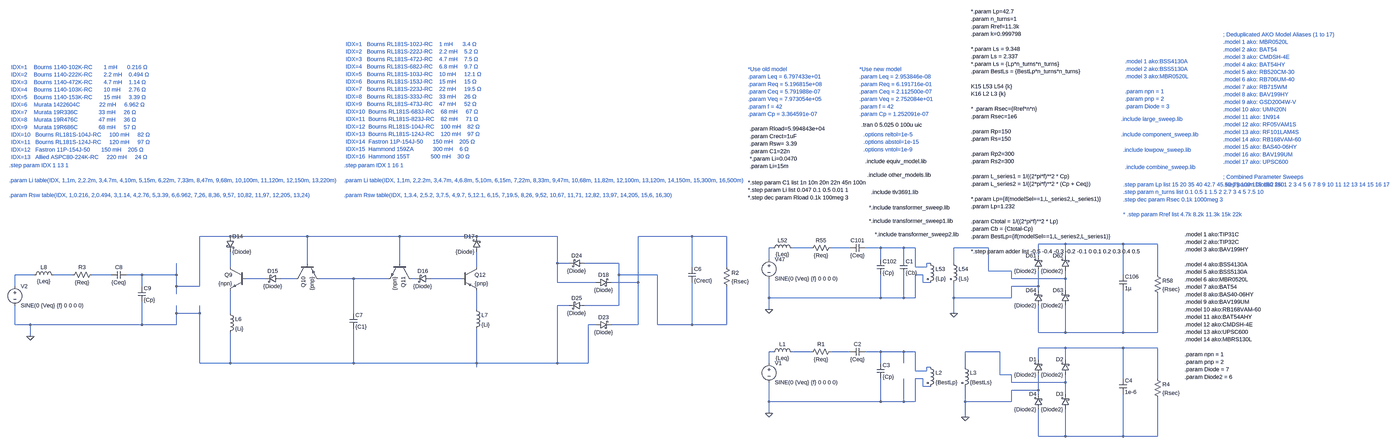
[diagram p0: schematic peh.asc, whole sheet]
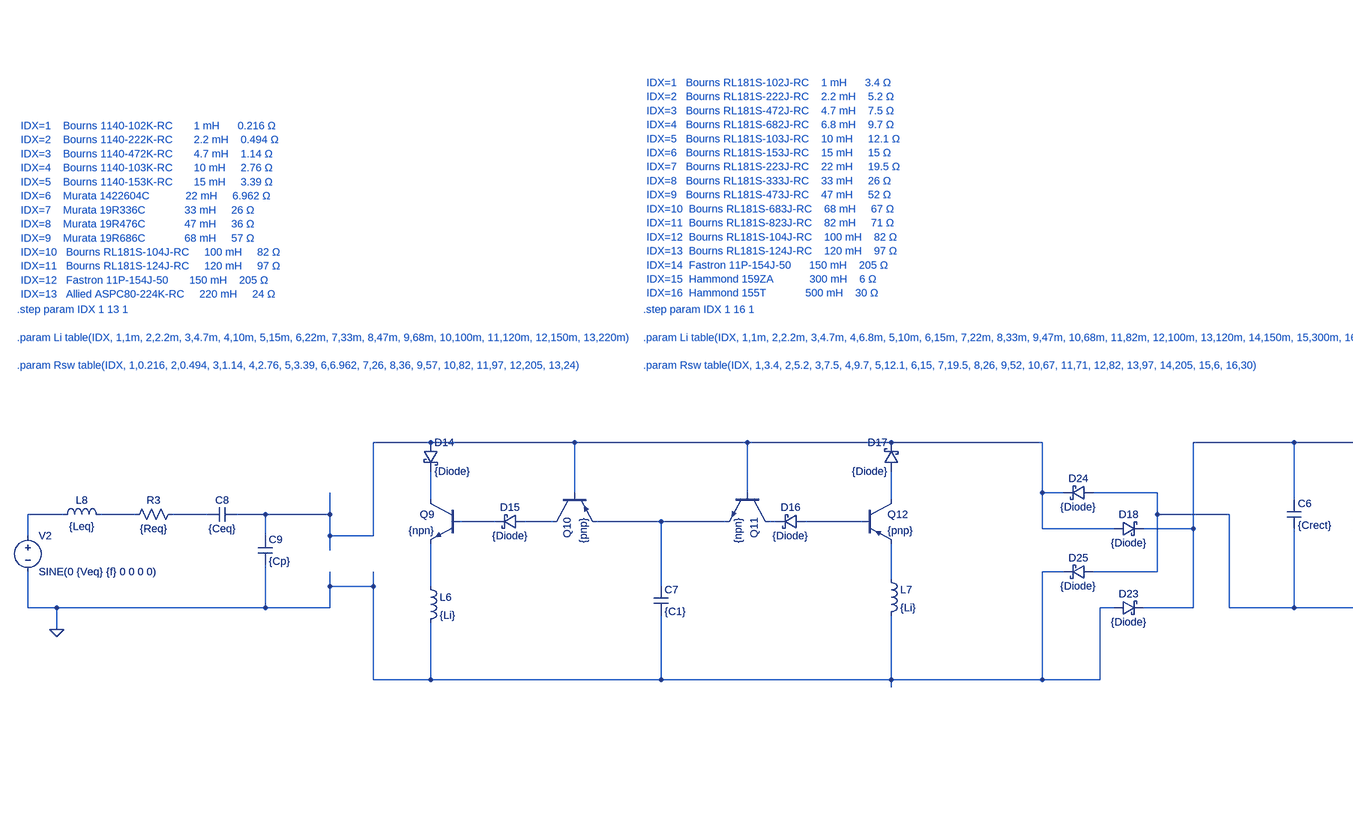
[diagram p1: schematic peh.asc, part, row 1 of 1, column 1 of 2]
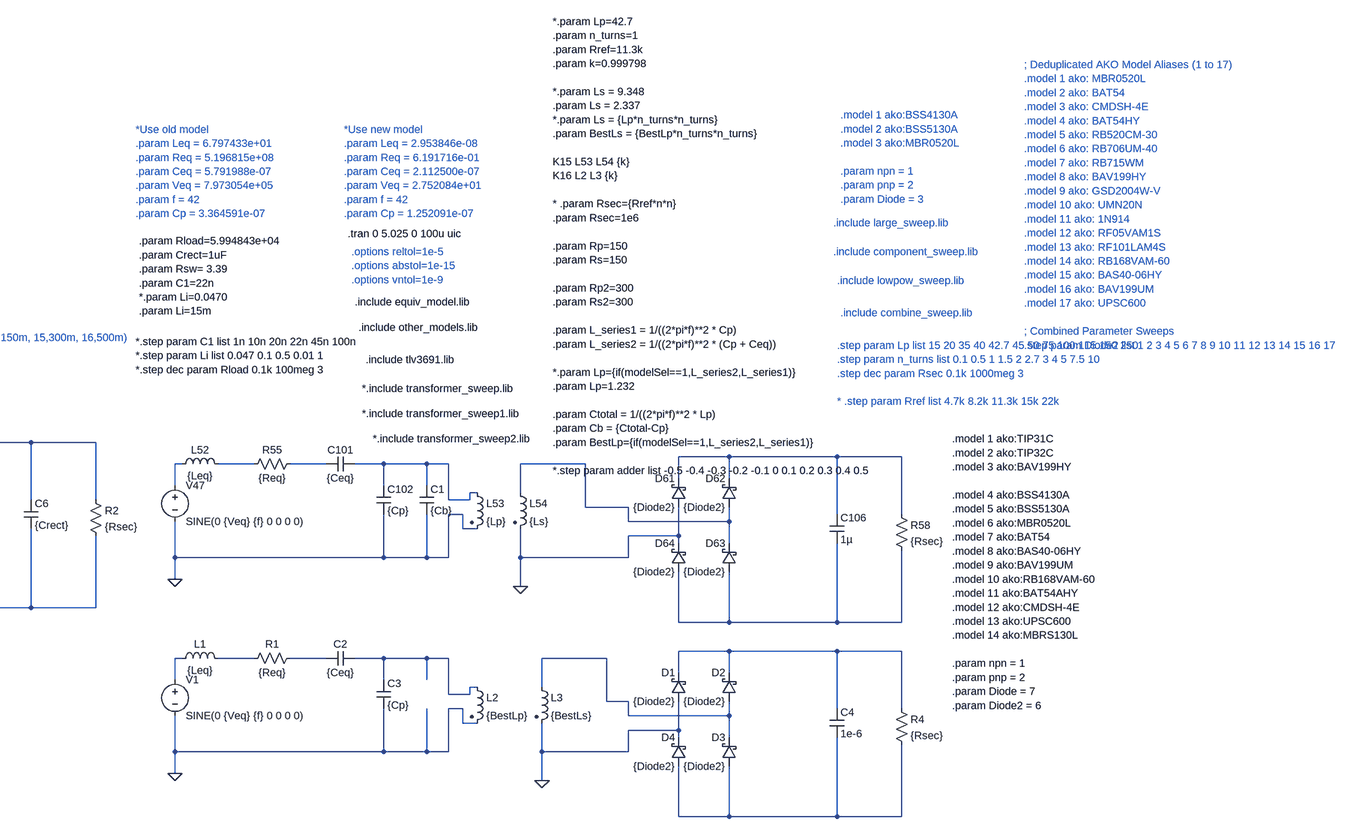
[diagram p2: schematic peh.asc, part, row 1 of 1, column 2 of 2]
peh.asc, the LTspice schematic file:
Version 4
SHEET 1 86052 56212
WIRE 1072 464 944 464
WIRE 1392 464 1072 464
WIRE 1776 464 1392 464
WIRE 2096 464 1776 464
WIRE 2432 464 2096 464
WIRE 2992 464 2768 464
WIRE 3136 464 2992 464
WIRE 4544 496 4432 496
WIRE 4784 496 4544 496
WIRE 4928 496 4784 496
WIRE 3328 512 3312 512
WIRE 3488 512 3408 512
WIRE 3648 512 3568 512
WIRE 3776 512 3712 512
WIRE 3872 512 3776 512
WIRE 3920 512 3872 512
WIRE 4224 512 4080 512
WIRE 4432 544 4432 496
WIRE 4544 544 4544 496
WIRE 3312 560 3312 512
WIRE 3776 560 3776 512
WIRE 3872 560 3872 512
WIRE 1392 576 1392 464
WIRE 1776 576 1776 464
WIRE 2432 576 2432 464
WIRE 2480 576 2432 576
WIRE 2688 576 2544 576
WIRE 3984 576 3968 576
WIRE 4080 576 4080 512
WIRE 1072 592 1072 528
WIRE 2096 592 2096 528
WIRE 2992 592 2992 464
WIRE 3136 592 3136 464
WIRE 3920 592 3920 512
WIRE 3968 592 3968 576
WIRE 3968 592 3920 592
WIRE 4224 608 4224 512
WIRE 4320 608 4224 608
WIRE 256 624 176 624
WIRE 416 624 336 624
WIRE 576 624 496 624
WIRE 704 624 640 624
WIRE 848 624 848 576
WIRE 848 624 704 624
WIRE 2688 624 2688 576
WIRE 2848 624 2688 624
WIRE 3952 624 3920 624
WIRE 4784 624 4784 496
WIRE 4928 624 4928 496
WIRE 1216 640 1136 640
WIRE 1344 640 1280 640
WIRE 1584 640 1440 640
WIRE 1728 640 1584 640
WIRE 1840 640 1824 640
WIRE 2032 640 1904 640
WIRE 4320 640 4320 608
WIRE 4544 640 4544 608
WIRE 4544 640 4320 640
WIRE 2432 656 2432 576
WIRE 2592 656 2432 656
WIRE 2768 656 2768 464
WIRE 2768 656 2656 656
WIRE 3952 656 3952 624
WIRE 3984 656 3952 656
WIRE 176 672 176 624
WIRE 704 672 704 624
WIRE 848 672 848 624
WIRE 944 672 944 464
WIRE 944 672 848 672
WIRE 4432 672 4432 608
WIRE 4432 672 4320 672
WIRE 4432 688 4432 672
WIRE 4544 688 4544 640
WIRE 848 704 848 672
WIRE 3312 720 3312 640
WIRE 3776 720 3776 624
WIRE 3776 720 3312 720
WIRE 3872 720 3872 624
WIRE 3872 720 3776 720
WIRE 3920 720 3920 624
WIRE 3920 720 3872 720
WIRE 4080 720 4080 656
WIRE 4320 720 4320 672
WIRE 4320 720 4080 720
WIRE 2480 752 2432 752
WIRE 2688 752 2688 624
WIRE 2688 752 2544 752
WIRE 2096 768 2096 688
WIRE 3312 768 3312 720
WIRE 848 784 848 752
WIRE 944 784 944 752
WIRE 944 784 848 784
WIRE 1072 784 1072 688
WIRE 1584 784 1584 640
WIRE 4080 784 4080 720
WIRE 176 832 176 752
WIRE 240 832 176 832
WIRE 704 832 704 736
WIRE 704 832 240 832
WIRE 848 832 848 784
WIRE 848 832 704 832
WIRE 2592 832 2560 832
WIRE 2768 832 2768 656
WIRE 2768 832 2656 832
WIRE 2848 832 2848 624
WIRE 2992 832 2992 656
WIRE 2992 832 2848 832
WIRE 3136 832 3136 672
WIRE 3136 832 2992 832
WIRE 4432 864 4432 752
WIRE 4544 864 4544 752
WIRE 4544 864 4432 864
WIRE 4784 864 4784 688
WIRE 4784 864 4544 864
WIRE 4928 864 4928 704
WIRE 4928 864 4784 864
WIRE 240 880 240 832
WIRE 4544 928 4432 928
WIRE 4784 928 4544 928
WIRE 4928 928 4784 928
WIRE 3328 944 3312 944
WIRE 3488 944 3408 944
WIRE 3648 944 3568 944
WIRE 3776 944 3712 944
WIRE 3872 944 3776 944
WIRE 3920 944 3872 944
WIRE 4272 944 4128 944
WIRE 4432 976 4432 928
WIRE 4544 976 4544 928
WIRE 944 992 944 784
WIRE 1072 992 1072 864
WIRE 1072 992 944 992
WIRE 1584 992 1584 848
WIRE 1584 992 1072 992
WIRE 2096 992 2096 848
WIRE 2096 992 1584 992
WIRE 2432 992 2432 752
WIRE 2432 992 2096 992
WIRE 2560 992 2560 832
WIRE 2560 992 2432 992
WIRE 3312 992 3312 944
WIRE 3776 992 3776 944
WIRE 3872 992 3872 944
WIRE 2096 1008 2096 992
WIRE 3984 1008 3968 1008
WIRE 4128 1008 4128 944
WIRE 3920 1024 3920 944
WIRE 3968 1024 3968 1008
WIRE 3968 1024 3920 1024
WIRE 4272 1040 4272 944
WIRE 4320 1040 4272 1040
WIRE 3952 1056 3920 1056
WIRE 4784 1056 4784 928
WIRE 4928 1056 4928 928
WIRE 4320 1072 4320 1040
WIRE 4544 1072 4544 1040
WIRE 4544 1072 4320 1072
WIRE 3952 1088 3952 1056
WIRE 3984 1088 3952 1088
WIRE 4432 1104 4432 1040
WIRE 4432 1104 4320 1104
WIRE 4432 1120 4432 1104
WIRE 4544 1120 4544 1072
WIRE 3312 1152 3312 1072
WIRE 3776 1152 3776 1056
WIRE 3776 1152 3312 1152
WIRE 3872 1152 3872 1056
WIRE 3872 1152 3776 1152
WIRE 3920 1152 3920 1056
WIRE 3920 1152 3872 1152
WIRE 4128 1152 4128 1088
WIRE 4320 1152 4320 1104
WIRE 4320 1152 4128 1152
WIRE 3312 1200 3312 1152
WIRE 4128 1216 4128 1152
WIRE 4432 1296 4432 1184
WIRE 4544 1296 4544 1184
WIRE 4544 1296 4432 1296
WIRE 4784 1296 4784 1120
WIRE 4784 1296 4544 1296
WIRE 4928 1296 4928 1136
WIRE 4928 1296 4784 1296
FLAG 240 880 0
FLAG 3312 768 0
FLAG 4080 784 0
FLAG 3312 1200 0
FLAG 4128 1216 0
SYMBOL schottky 1056 464 R0
SYMATTR InstName D14
SYMATTR Value {Diode}
SYMBOL npn 1136 592 M0
SYMATTR InstName Q9
SYMATTR Value {npn}
SYMBOL schottky 1280 624 R90
WINDOW 0 0 32 VBottom 2
WINDOW 3 32 32 VTop 2
SYMATTR InstName D15
SYMATTR Value {Diode}
SYMBOL schottky 1904 624 R90
WINDOW 0 0 32 VBottom 2
WINDOW 3 32 32 VTop 2
SYMATTR InstName D16
SYMATTR Value {Diode}
SYMBOL pnp 1344 576 M90
SYMATTR InstName Q10
SYMATTR Value {pnp}
SYMBOL npn 1824 576 R90
SYMATTR InstName Q11
SYMATTR Value {npn}
SYMBOL ind 1056 768 R0
SYMATTR InstName L6
SYMATTR Value {Li}
SYMATTR SpiceLine Rser={Rsw}
SYMBOL ind 2080 752 R0
SYMATTR InstName L7
SYMATTR Value {Li}
SYMATTR SpiceLine Rser={Rsw}
SYMBOL pnp 2032 592 R0
SYMATTR InstName Q12
SYMATTR Value {pnp}
SYMBOL schottky 2112 528 R180
WINDOW 0 24 64 Left 2
WINDOW 3 24 0 Left 2
SYMATTR InstName D17
SYMATTR Value {Diode}
SYMBOL schottky 2592 672 R270
WINDOW 0 32 32 VTop 2
WINDOW 3 0 32 VBottom 2
SYMATTR InstName D18
SYMATTR Value {Diode}
SYMBOL schottky 2592 848 R270
WINDOW 0 32 32 VTop 2
WINDOW 3 0 32 VBottom 2
SYMATTR InstName D23
SYMATTR Value {Diode}
SYMBOL schottky 2544 560 R90
WINDOW 0 0 32 VBottom 2
WINDOW 3 32 32 VTop 2
SYMATTR InstName D24
SYMATTR Value {Diode}
SYMBOL schottky 2544 736 R90
WINDOW 0 0 32 VBottom 2
WINDOW 3 32 32 VTop 2
SYMATTR InstName D25
SYMATTR Value {Diode}
SYMBOL cap 2976 592 R0
SYMATTR InstName C6
SYMATTR Value {Crect}
SYMBOL res 3120 576 R0
SYMATTR InstName R2
SYMATTR Value {Rsec}
SYMBOL cap 1568 784 R0
SYMATTR InstName C7
SYMATTR Value {C1}
SYMBOL voltage 176 656 R0
WINDOW 123 0 0 Left 0
WINDOW 39 0 0 Left 0
SYMATTR InstName V2
SYMATTR Value SINE(0 {Veq} {f} 0 0 0 0)
SYMBOL res 512 608 R90
WINDOW 0 0 56 VBottom 2
WINDOW 3 32 56 VTop 2
SYMATTR InstName R3
SYMATTR Value {Req}
SYMBOL ind 240 640 R270
WINDOW 0 32 56 VTop 2
WINDOW 3 5 56 VBottom 2
SYMATTR InstName L8
SYMATTR Value {Leq}
SYMBOL cap 640 608 R90
WINDOW 0 0 32 VBottom 2
WINDOW 3 32 32 VTop 2
SYMATTR InstName C8
SYMATTR Value {Ceq}
SYMBOL cap 688 672 R0
SYMATTR InstName C9
SYMATTR Value {Cp}
SYMBOL res 3584 496 R90
WINDOW 0 0 56 VBottom 2
WINDOW 3 32 56 VTop 2
SYMATTR InstName R55
SYMATTR Value {Req}
SYMBOL ind 3312 528 R270
WINDOW 0 32 56 VTop 2
WINDOW 3 5 56 VBottom 2
SYMATTR InstName L52
SYMATTR Value {Leq}
SYMBOL cap 3712 496 R90
WINDOW 0 0 32 VBottom 2
WINDOW 3 32 32 VTop 2
SYMATTR InstName C101
SYMATTR Value {Ceq}
SYMBOL cap 3760 560 R0
SYMATTR InstName C102
SYMATTR Value {Cp}
SYMBOL voltage 3312 544 R0
WINDOW 123 0 0 Left 0
WINDOW 39 0 0 Left 0
SYMATTR InstName V47
SYMATTR Value SINE(0 {Veq} {f} 0 0 0 0)
SYMBOL ind2 3968 560 R0
SYMATTR InstName L53
SYMATTR Value {Lp}
SYMATTR Type ind
SYMATTR SpiceLine Rser={Rp}
SYMBOL ind2 4064 560 R0
SYMATTR InstName L54
SYMATTR Value {Ls}
SYMATTR Type ind
SYMATTR SpiceLine Rser={Rs}
SYMBOL cap 4768 624 R0
SYMATTR InstName C106
SYMATTR Value 1µ
SYMBOL res 4912 608 R0
SYMATTR InstName R58
SYMATTR Value {Rsec}
SYMBOL schottky 4448 608 R180
WINDOW 0 24 64 Left 2
WINDOW 3 24 0 Left 2
SYMATTR InstName D61
SYMATTR Value {Diode2}
SYMBOL schottky 4560 608 R180
WINDOW 0 24 64 Left 2
WINDOW 3 24 0 Left 2
SYMATTR InstName D62
SYMATTR Value {Diode2}
SYMBOL schottky 4560 752 R180
WINDOW 0 24 64 Left 2
WINDOW 3 24 0 Left 2
SYMATTR InstName D63
SYMATTR Value {Diode2}
SYMBOL schottky 4448 752 R180
WINDOW 0 24 64 Left 2
WINDOW 3 24 0 Left 2
SYMATTR InstName D64
SYMATTR Value {Diode2}
SYMBOL cap 3856 560 R0
SYMATTR InstName C1
SYMATTR Value {Cb}
SYMBOL res 3584 928 R90
WINDOW 0 0 56 VBottom 2
WINDOW 3 32 56 VTop 2
SYMATTR InstName R1
SYMATTR Value {Req}
SYMBOL ind 3312 960 R270
WINDOW 0 32 56 VTop 2
WINDOW 3 5 56 VBottom 2
SYMATTR InstName L1
SYMATTR Value {Leq}
SYMBOL cap 3712 928 R90
WINDOW 0 0 32 VBottom 2
WINDOW 3 32 32 VTop 2
SYMATTR InstName C2
SYMATTR Value {Ceq}
SYMBOL cap 3760 992 R0
SYMATTR InstName C3
SYMATTR Value {Cp}
SYMBOL voltage 3312 976 R0
WINDOW 123 0 0 Left 0
WINDOW 39 0 0 Left 0
SYMATTR InstName V1
SYMATTR Value SINE(0 {Veq} {f} 0 0 0 0)
SYMBOL ind2 3968 992 R0
SYMATTR InstName L2
SYMATTR Value {BestLp}
SYMATTR Type ind
SYMATTR SpiceLine Rser={Rp2}
SYMBOL ind2 4112 992 R0
SYMATTR InstName L3
SYMATTR Value {BestLs}
SYMATTR Type ind
SYMATTR SpiceLine Rser={Rs2}
SYMBOL cap 4768 1056 R0
SYMATTR InstName C4
SYMATTR Value 1e-6
SYMBOL res 4912 1040 R0
SYMATTR InstName R4
SYMATTR Value {Rsec}
SYMBOL schottky 4448 1040 R180
WINDOW 0 24 64 Left 2
WINDOW 3 24 0 Left 2
SYMATTR InstName D1
SYMATTR Value {Diode2}
SYMBOL schottky 4560 1040 R180
WINDOW 0 24 64 Left 2
WINDOW 3 24 0 Left 2
SYMATTR InstName D2
SYMATTR Value {Diode2}
SYMBOL schottky 4560 1184 R180
WINDOW 0 24 64 Left 2
WINDOW 3 24 0 Left 2
SYMATTR InstName D3
SYMATTR Value {Diode2}
SYMBOL schottky 4448 1184 R180
WINDOW 0 24 64 Left 2
WINDOW 3 24 0 Left 2
SYMATTR InstName D4
SYMATTR Value {Diode2}
TEXT 3696 0 Left 2 !.tran 0 5.025 0 100u uic
TEXT 3232 16 Left 2 !.param Rload=5.994843e+04\n.param Crect=1uF\n.param Rsw= 3.39\n.param C1=22n\n*.param Li=0.0470\n.param Li=15m
TEXT 3224 240 Left 2 !*.step param C1 list 1n 10n 20n 22n 45n 100n\n*.step param Li list 0.047 0.1 0.5 0.01 1\n*.step dec param Rload 0.1k 100meg 3
TEXT 3224 -232 Left 2 ;*Use old model\n.param Leq = 6.797433e+01\n.param Req = 5.196815e+08\n.param Ceq = 5.791988e-07\n.param Veq = 7.973054e+05\n.param f = 42\n.param Cp = 3.364591e-07
TEXT 3688 -232 Left 2 ;*Use new model\n.param Leq = 2.953846e-08\n.param Req = 6.191716e-01\n.param Ceq = 2.112500e-07\n.param Veq = 2.752084e+01\n.param f = 42\n.param Cp = 1.252091e-07
TEXT 4776 40 Left 2 ;.include component_sweep.lib
TEXT 5040 456 Left 2 !.model 1 ako:TIP31C\n.model 2 ako:TIP32C\n.model 3 ako:BAV199HY\n \n.model 4 ako:BSS4130A\n.model 5 ako:BSS5130A\n.model 6 ako:MBR0520L\n.model 7 ako:BAT54\n.model 8 ako:BAS40-06HY\n.model 9 ako:BAV199UM\n.model 10 ako:RB168VAM-60\n.model 11 ako:BAT54AHY\n.model 12 ako:CMDSH-4E\n.model 13 ako:UPSC600\n.model 14 ako:MBRS130L\n \n.param npn = 1\n.param pnp = 2\n.param Diode = 7\n.param Diode2 = 6
TEXT 3712 152 Left 2 !.include equiv_model.lib
TEXT 3720 208 Left 2 !.include other_models.lib
TEXT 4776 -24 Left 2 ;.include large_sweep.lib
TEXT 4784 104 Left 2 ;.include lowpow_sweep.lib
TEXT 4792 176 Left 2 ;.include combine_sweep.lib
TEXT 4792 -264 Left 2 ;.model 1 ako:BSS4130A\n.model 2 ako:BSS5130A\n.model 3 ako:MBR0520L\n \n.param npn = 1\n.param pnp = 2\n.param Diode = 3
TEXT 3736 280 Left 2 !.include tlv3691.lib
TEXT 4152 -472 Left 2 !*.param Lp=42.7\n.param n_turns=1\n.param Rref=11.3k\n.param k=0.999798\n \n*.param Ls = 9.348\n.param Ls = 2.337\n*.param Ls = {Lp*n_turns*n_turns}\n.param BestLs = {BestLp*n_turns*n_turns}\n \nK15 L53 L54 {k}\nK16 L2 L3 {k}\n \n* .param Rsec={Rref*n*n}\n.param Rsec=1e6\n \n.param Rp=150\n.param Rs=150\n \n.param Rp2=300\n.param Rs2=300\n \n.param L_series1 = 1/((2*pi*f)**2 * Cp)\n.param L_series2 = 1/((2*pi*f)**2 * (Cp + Ceq))\n \n*.param Lp={if(modelSel==1,L_series2,L_series1)}\n.param Lp=1.232\n \n.param Ctotal = 1/((2*pi*f)**2 * Lp)\n.param Cb = {Ctotal-Cp}\n.param BestLp={if(modelSel==1,L_series2,L_series1)}\n \n*.step param adder list -0.5 -0.4 -0.3 -0.2 -0.1 0 0.1 0.2 0.3 0.4 0.5
TEXT 4784 248 Left 2 ;.step param Lp list 15 20 35 40 42.7 45 50 75 100 115 150 250\n.step param n_turns list 0.1 0.5 1 1.5 2 2.7 3 4 5 7.5 10\n.step dec param Rsec 0.1k 1000meg 3\n \n* .step param Rref list 4.7k 8.2k 11.3k 15k 22k
TEXT 3728 344 Left 2 !*.include transformer_sweep.lib
TEXT 3728 400 Left 2 !*.include transformer_sweep1.lib
TEXT 3704 40 Left 2 ;.options reltol=1e-5\n.options abstol=1e-15\n.options vntol=1e-9
TEXT 3752 456 Left 2 !*.include transformer_sweep2.lib
TEXT 5200 -376 Left 2 ;; Deduplicated AKO Model Aliases (1 to 17)\n.model 1 ako: MBR0520L\n.model 2 ako: BAT54\n.model 3 ako: CMDSH-4E\n.model 4 ako: BAT54HY\n.model 5 ako: RB520CM-30\n.model 6 ako: RB706UM-40\n.model 7 ako: RB715WM\n.model 8 ako: BAV199HY\n.model 9 ako: GSD2004W-V\n.model 10 ako: UMN20N\n.model 11 ako: 1N914\n.model 12 ako: RF05VAM1S\n.model 13 ako: RF101LAM4S\n.model 14 ako: RB168VAM-60\n.model 15 ako: BAS40-06HY\n.model 16 ako: BAV199UM\n.model 17 ako: UPSC600\n \n; Combined Parameter Sweeps\n.step param Diode2 list 1 2 3 4 5 6 7 8 9 10 11 12 13 14 15 16 17
TEXT 1544 168 Left 2 ;.step param IDX 1 16 1\n \n.param Li table(IDX, 1,1m, 2,2.2m, 3,4.7m, 4,6.8m, 5,10m, 6,15m, 7,22m, 8,33m, 9,47m, 10,68m, 11,82m, 12,100m, 13,120m, 14,150m, 15,300m, 16,500m)\n \n.param Rsw table(IDX, 1,3.4, 2,5.2, 3,7.5, 4,9.7, 5,12.1, 6,15, 7,19.5, 8,26, 9,52, 10,67, 11,71, 12,82, 13,97, 14,205, 15,6, 16,30)
TEXT 1552 -336 Left 2 ;IDX=1   Bourns RL181S-102J-RC    1 mH      3.4 Ω\nIDX=2   Bourns RL181S-222J-RC    2.2 mH    5.2 Ω\nIDX=3   Bourns RL181S-472J-RC    4.7 mH    7.5 Ω\nIDX=4   Bourns RL181S-682J-RC    6.8 mH    9.7 Ω\nIDX=5   Bourns RL181S-103J-RC    10 mH     12.1 Ω\nIDX=6   Bourns RL181S-153J-RC    15 mH     15 Ω\nIDX=7   Bourns RL181S-223J-RC    22 mH     19.5 Ω\nIDX=8   Bourns RL181S-333J-RC    33 mH     26 Ω\nIDX=9   Bourns RL181S-473J-RC    47 mH     52 Ω\nIDX=10  Bourns RL181S-683J-RC    68 mH     67 Ω\nIDX=11  Bourns RL181S-823J-RC    82 mH     71 Ω\nIDX=12  Bourns RL181S-104J-RC    100 mH    82 Ω\nIDX=13  Bourns RL181S-124J-RC    120 mH    97 Ω\nIDX=14  Fastron 11P-154J-50      150 mH    205 Ω\nIDX=15  Hammond 159ZA            300 mH    6 Ω\nIDX=16  Hammond 155T             500 mH    30 Ω
TEXT 152 168 Left 2 ;.step param IDX 1 13 1\n \n.param Li table(IDX, 1,1m, 2,2.2m, 3,4.7m, 4,10m, 5,15m, 6,22m, 7,33m, 8,47m, 9,68m, 10,100m, 11,120m, 12,150m, 13,220m)\n \n.param Rsw table(IDX, 1,0.216, 2,0.494, 3,1.14, 4,2.76, 5,3.39, 6,6.962, 7,26, 8,36, 9,57, 10,82, 11,97, 12,205, 13,24)
TEXT 160 -240 Left 2 ;IDX=1    Bourns 1140-102K-RC       1 mH      0.216 Ω\nIDX=2    Bourns 1140-222K-RC       2.2 mH    0.494 Ω\nIDX=3    Bourns 1140-472K-RC       4.7 mH    1.14 Ω\nIDX=4    Bourns 1140-103K-RC       10 mH     2.76 Ω\nIDX=5    Bourns 1140-153K-RC       15 mH     3.39 Ω\nIDX=6    Murata 1422604C            22 mH     6.962 Ω\nIDX=7    Murata 19R336C             33 mH     26 Ω\nIDX=8    Murata 19R476C             47 mH     36 Ω\nIDX=9    Murata 19R686C             68 mH     57 Ω\nIDX=10   Bourns RL181S-104J-RC     100 mH     82 Ω\nIDX=11   Bourns RL181S-124J-RC     120 mH     97 Ω\nIDX=12   Fastron 11P-154J-50       150 mH    205 Ω\nIDX=13   Allied ASPC80-224K-RC     220 mH     24 Ω

The netlist it stands for:
* peh.asc
D14 N001 N010 {Diode}
Q9 N010 N015 N021 0 {npn}
D15 N016 N015 {Diode}
D16 N019 N018 {Diode}
Q10 N016 N001 N017 0 {pnp}
Q11 N018 N001 N017 0 {npn}
L6 N021 0 {Li} Rser={Rsw}
L7 N020 0 {Li} Rser={Rsw}
Q12 N011 N019 N020 0 {pnp}
D17 N011 N001 {Diode}
D18 N001 N002 {Diode}
D23 0 N002 {Diode}
D24 N009 N001 {Diode}
D25 N009 0 {Diode}
C6 N002 N009 {Crect}
R2 N002 N009 {Rsec}
C7 N017 0 {C1}
V2 N012 0 SINE(0 {Veq} {f} 0 0 0 0)
R3 N014 N013 {Req}
L8 N012 N013 {Leq}
C8 N001 N014 {Ceq}
C9 N001 0 {Cp}
R55 N006 N005 {Req}
L52 N004 N005 {Leq}
C101 N007 N006 {Ceq}
C102 N007 0 {Cp}
V47 N004 0 SINE(0 {Veq} {f} 0 0 0 0)
L53 N007 0 {Lp} Rser={Rp}
L54 N008 0 {Ls} Rser={Rs}
C106 N003 N022 1µ
R58 N003 N022 {Rsec}
D61 0 N003 {Diode2}
D62 N008 N003 {Diode2}
D63 N022 N008 {Diode2}
D64 N022 0 {Diode2}
C1 N007 0 {Cb}
R1 N026 N025 {Req}
L1 N024 N025 {Leq}
C2 N027 N026 {Ceq}
C3 N027 0 {Cp}
V1 N024 0 SINE(0 {Veq} {f} 0 0 0 0)
L2 N027 0 {BestLp} Rser={Rp2}
L3 N028 0 {BestLs} Rser={Rs2}
C4 N023 N029 1e-6
R4 N023 N029 {Rsec}
D1 0 N023 {Diode2}
D2 N028 N023 {Diode2}
D3 N029 N028 {Diode2}
D4 N029 0 {Diode2}
.model D D
.lib standard.dio
.model NPN NPN
.model PNP PNP
.lib standard.bjt
.tran 0 5.025 0 100u uic
.param Rload=5.994843e+04
.param Crect=1uF
.param Rsw= 3.39
.param C1=22n
*.param Li=0.0470
.param Li=15m
*.step param C1 list 1n 10n 20n 22n 45n 100n
*.step param Li list 0.047 0.1 0.5 0.01 1
*.step dec param Rload 0.1k 100meg 3
* *Use old model
* .param Leq = 6.797433e+01
* .param Req = 5.196815e+08
* .param Ceq = 5.791988e-07
* .param Veq = 7.973054e+05
* .param f = 42
* .param Cp = 3.364591e-07
* *Use new model
* .param Leq = 2.953846e-08
* .param Req = 6.191716e-01
* .param Ceq = 2.112500e-07
* .param Veq = 2.752084e+01
* .param f = 42
* .param Cp = 1.252091e-07
* .include component_sweep.lib
.model 1 ako:TIP31C
.model 2 ako:TIP32C
.model 3 ako:BAV199HY
.model 4 ako:BSS4130A
.model 5 ako:BSS5130A
.model 6 ako:MBR0520L
.model 7 ako:BAT54
.model 8 ako:BAS40-06HY
.model 9 ako:BAV199UM
.model 10 ako:RB168VAM-60
.model 11 ako:BAT54AHY
.model 12 ako:CMDSH-4E
.model 13 ako:UPSC600
.model 14 ako:MBRS130L
.param npn = 1
.param pnp = 2
.param Diode = 7
.param Diode2 = 6
.include equiv_model.lib
.include other_models.lib
* .include large_sweep.lib
* .include lowpow_sweep.lib
* .include combine_sweep.lib
* .model 1 ako:BSS4130A
* .model 2 ako:BSS5130A
* .model 3 ako:MBR0520L
* .param npn = 1
* .param pnp = 2
* .param Diode = 3
.include tlv3691.lib
*.param Lp=42.7
.param n_turns=1
.param Rref=11.3k
.param k=0.999798
*.param Ls = 9.348
.param Ls = 2.337
*.param Ls = {Lp*n_turns*n_turns}
.param BestLs = {BestLp*n_turns*n_turns}
K15 L53 L54 {k}
K16 L2 L3 {k}
* .param Rsec={Rref*n*n}
.param Rsec=1e6
.param Rp=150
.param Rs=150
.param Rp2=300
.param Rs2=300
.param L_series1 = 1/((2*pi*f)**2 * Cp)
.param L_series2 = 1/((2*pi*f)**2 * (Cp + Ceq))
*.param Lp={if(modelSel==1,L_series2,L_series1)}
.param Lp=1.232
.param Ctotal = 1/((2*pi*f)**2 * Lp)
.param Cb = {Ctotal-Cp}
.param BestLp={if(modelSel==1,L_series2,L_series1)}
*.step param adder list -0.5 -0.4 -0.3 -0.2 -0.1 0 0.1 0.2 0.3 0.4 0.5
* .step param Lp list 15 20 35 40 42.7 45 50 75 100 115 150 250
* .step param n_turns list 0.1 0.5 1 1.5 2 2.7 3 4 5 7.5 10
* .step dec param Rsec 0.1k 1000meg 3
* * .step param Rref list 4.7k 8.2k 11.3k 15k 22k
*.include transformer_sweep.lib
*.include transformer_sweep1.lib
* .options reltol=1e-5
* .options abstol=1e-15
* .options vntol=1e-9
*.include transformer_sweep2.lib
* ; Deduplicated AKO Model Aliases (1 to 17)
* .model 1 ako: MBR0520L
* .model 2 ako: BAT54
* .model 3 ako: CMDSH-4E
* .model 4 ako: BAT54HY
* .model 5 ako: RB520CM-30
* .model 6 ako: RB706UM-40
* .model 7 ako: RB715WM
* .model 8 ako: BAV199HY
* .model 9 ako: GSD2004W-V
* .model 10 ako: UMN20N
* .model 11 ako: 1N914
* .model 12 ako: RF05VAM1S
* .model 13 ako: RF101LAM4S
* .model 14 ako: RB168VAM-60
* .model 15 ako: BAS40-06HY
* .model 16 ako: BAV199UM
* .model 17 ako: UPSC600
* ; Combined Parameter Sweeps
* .step param Diode2 list 1 2 3 4 5 6 7 8 9 10 11 12 13 14 15 16 17
* .step param IDX 1 16 1
* .param Li table(IDX, 1,1m, 2,2.2m, 3,4.7m, 4,6.8m, 5,10m, 6,15m, 7,22m, 8,33m, 9,47m, 10,68m, 11,82m, 12,100m, 13,120m, 14,150m, 15,300m, 16,500m)
* .param Rsw table(IDX, 1,3.4, 2,5.2, 3,7.5, 4,9.7, 5,12.1, 6,15, 7,19.5, 8,26, 9,52, 10,67, 11,71, 12,82, 13,97, 14,205, 15,6, 16,30)
* IDX=1   Bourns RL181S-102J-RC    1 mH      3.4 Ω
* IDX=2   Bourns RL181S-222J-RC    2.2 mH    5.2 Ω
* IDX=3   Bourns RL181S-472J-RC    4.7 mH    7.5 Ω
* IDX=4   Bourns RL181S-682J-RC    6.8 mH    9.7 Ω
* IDX=5   Bourns RL181S-103J-RC    10 mH     12.1 Ω
* IDX=6   Bourns RL181S-153J-RC    15 mH     15 Ω
* IDX=7   Bourns RL181S-223J-RC    22 mH     19.5 Ω
* IDX=8   Bourns RL181S-333J-RC    33 mH     26 Ω
* IDX=9   Bourns RL181S-473J-RC    47 mH     52 Ω
* IDX=10  Bourns RL181S-683J-RC    68 mH     67 Ω
* IDX=11  Bourns RL181S-823J-RC    82 mH     71 Ω
* IDX=12  Bourns RL181S-104J-RC    100 mH    82 Ω
* IDX=13  Bourns RL181S-124J-RC    120 mH    97 Ω
* IDX=14  Fastron 11P-154J-50      150 mH    205 Ω
* IDX=15  Hammond 159ZA            300 mH    6 Ω
* IDX=16  Hammond 155T             500 mH    30 Ω
* .step param IDX 1 13 1
* .param Li table(IDX, 1,1m, 2,2.2m, 3,4.7m, 4,10m, 5,15m, 6,22m, 7,33m, 8,47m, 9,68m, 10,100m, 11,120m, 12,150m, 13,220m)
* .param Rsw table(IDX, 1,0.216, 2,0.494, 3,1.14, 4,2.76, 5,3.39, 6,6.962, 7,26, 8,36, 9,57, 10,82, 11,97, 12,205, 13,24)
* IDX=1    Bourns 1140-102K-RC       1 mH      0.216 Ω
* IDX=2    Bourns 1140-222K-RC       2.2 mH    0.494 Ω
* IDX=3    Bourns 1140-472K-RC       4.7 mH    1.14 Ω
* IDX=4    Bourns 1140-103K-RC       10 mH     2.76 Ω
* IDX=5    Bourns 1140-153K-RC       15 mH     3.39 Ω
* IDX=6    Murata 1422604C            22 mH     6.962 Ω
* IDX=7    Murata 19R336C             33 mH     26 Ω
* IDX=8    Murata 19R476C             47 mH     36 Ω
* IDX=9    Murata 19R686C             68 mH     57 Ω
* IDX=10   Bourns RL181S-104J-RC     100 mH     82 Ω
* IDX=11   Bourns RL181S-124J-RC     120 mH     97 Ω
* IDX=12   Fastron 11P-154J-50       150 mH    205 Ω
* IDX=13   Allied ASPC80-224K-RC     220 mH     24 Ω
.backanno
.end